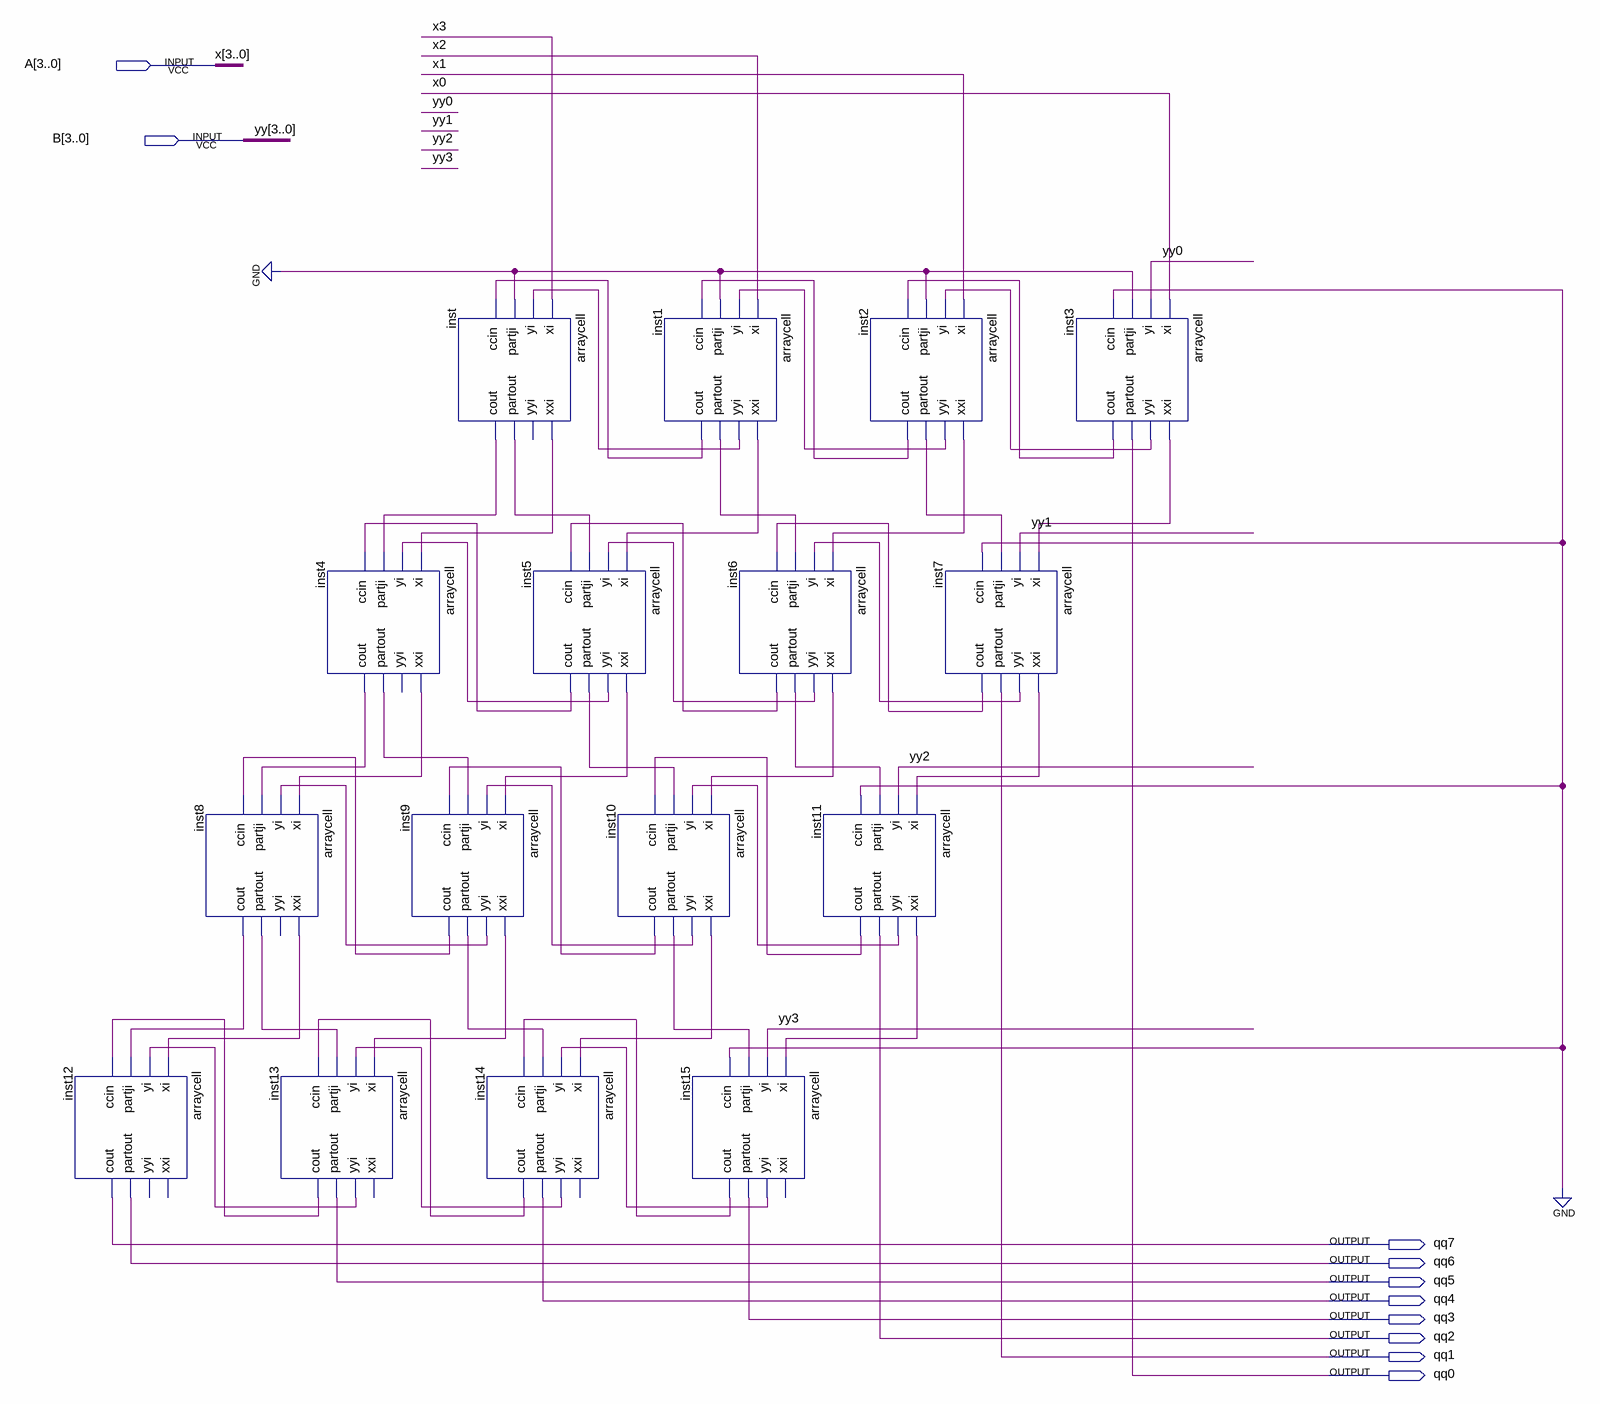
[diagram p0: schematic sheet]
// Quartus schematic mult.bdf as structural Verilog: 16 symbols, 10 pins
module mult (
  input  [3:0] A,
  input  [3:0] B,
  output qq7,
  output qq6,
  output qq5,
  output qq4,
  output qq3,
  output qq2,
  output qq1,
  output qq0
);

  wire inst1_cout, inst1_partout, inst1_xxi, inst1_yyi, inst2_cout, inst2_partout, inst2_xxi, inst2_yyi,
       inst3_cout, inst3_xxi, inst3_yyi, inst4_cout, inst4_partout, inst4_xxi, inst5_cout, inst5_partout,
       inst5_xxi, inst5_yyi, inst6_cout, inst6_partout, inst6_xxi, inst6_yyi, inst7_cout, inst7_xxi,
       inst7_yyi, inst8_cout, inst8_partout, inst8_xxi, inst9_cout, inst9_partout, inst9_xxi, inst9_yyi,
       inst10_cout, inst10_partout, inst10_xxi, inst10_yyi, inst11_cout, inst11_xxi, inst11_yyi, inst13_cout,
       inst13_yyi, inst14_cout, inst14_yyi, inst15_cout, inst15_yyi, inst_cout, inst_partout, inst_xxi;

  arraycell inst12 (
    .xi(inst8_xxi), .yi(inst13_yyi), .partji(inst8_cout), .ccin(inst13_cout), .partout(qq6), .cout(qq7));  // open: xxi, yyi
  arraycell inst8 (
    .xi(inst4_xxi), .yi(inst9_yyi), .partji(inst4_cout), .ccin(inst9_cout), .xxi(inst8_xxi),
    .partout(inst8_partout), .cout(inst8_cout));  // open: yyi
  arraycell inst4 (
    .xi(inst_xxi), .yi(inst5_yyi), .partji(inst_cout), .ccin(inst5_cout), .xxi(inst4_xxi),
    .partout(inst4_partout), .cout(inst4_cout));  // open: yyi
  arraycell inst13 (
    .xi(inst9_xxi), .yi(inst14_yyi), .partji(inst8_partout), .ccin(inst14_cout), .yyi(inst13_yyi),
    .partout(qq5), .cout(inst13_cout));  // open: xxi
  arraycell inst9 (
    .xi(inst5_xxi), .yi(inst10_yyi), .partji(inst4_partout), .ccin(inst10_cout), .xxi(inst9_xxi),
    .yyi(inst9_yyi), .partout(inst9_partout), .cout(inst9_cout));
  arraycell inst (
    .xi(A[3]), .yi(inst1_yyi), .partji(1'b0), .ccin(inst1_cout), .xxi(inst_xxi), .partout(inst_partout),
    .cout(inst_cout));  // open: yyi
  arraycell inst14 (
    .xi(inst10_xxi), .yi(inst15_yyi), .partji(inst9_partout), .ccin(inst15_cout), .yyi(inst14_yyi),
    .partout(qq4), .cout(inst14_cout));  // open: xxi
  arraycell inst5 (
    .xi(inst1_xxi), .yi(inst6_yyi), .partji(inst_partout), .ccin(inst6_cout), .xxi(inst5_xxi),
    .yyi(inst5_yyi), .partout(inst5_partout), .cout(inst5_cout));
  arraycell inst10 (
    .xi(inst6_xxi), .yi(inst11_yyi), .partji(inst5_partout), .ccin(inst11_cout), .xxi(inst10_xxi),
    .yyi(inst10_yyi), .partout(inst10_partout), .cout(inst10_cout));
  arraycell inst1 (
    .xi(A[2]), .yi(inst2_yyi), .partji(1'b0), .ccin(inst2_cout), .xxi(inst1_xxi), .yyi(inst1_yyi),
    .partout(inst1_partout), .cout(inst1_cout));
  arraycell inst15 (
    .xi(inst11_xxi), .yi(B[3]), .partji(inst10_partout), .ccin(1'b0), .yyi(inst15_yyi), .partout(qq3),
    .cout(inst15_cout));  // open: xxi
  arraycell inst6 (
    .xi(inst2_xxi), .yi(inst7_yyi), .partji(inst1_partout), .ccin(inst7_cout), .xxi(inst6_xxi),
    .yyi(inst6_yyi), .partout(inst6_partout), .cout(inst6_cout));
  arraycell inst11 (
    .xi(inst7_xxi), .yi(B[2]), .partji(inst6_partout), .ccin(1'b0), .xxi(inst11_xxi), .yyi(inst11_yyi),
    .partout(qq2), .cout(inst11_cout));
  arraycell inst2 (
    .xi(A[1]), .yi(inst3_yyi), .partji(1'b0), .ccin(inst3_cout), .xxi(inst2_xxi), .yyi(inst2_yyi),
    .partout(inst2_partout), .cout(inst2_cout));
  arraycell inst7 (
    .xi(inst3_xxi), .yi(B[1]), .partji(inst2_partout), .ccin(1'b0), .xxi(inst7_xxi), .yyi(inst7_yyi),
    .partout(qq1), .cout(inst7_cout));
  arraycell inst3 (
    .xi(A[0]), .yi(B[0]), .partji(1'b0), .ccin(1'b0), .xxi(inst3_xxi), .yyi(inst3_yyi), .partout(qq0),
    .cout(inst3_cout));

  // Other names for the same wires on the sheet: x[3:0] = A; x0 = A[0]; x1 = A[1]; x2 = A[2]; x3 = A[3]; yy[3:0] = B;
  //   yy0 = B[0]; yy1 = B[1]; yy2 = B[2]; yy3 = B[3]
endmodule
